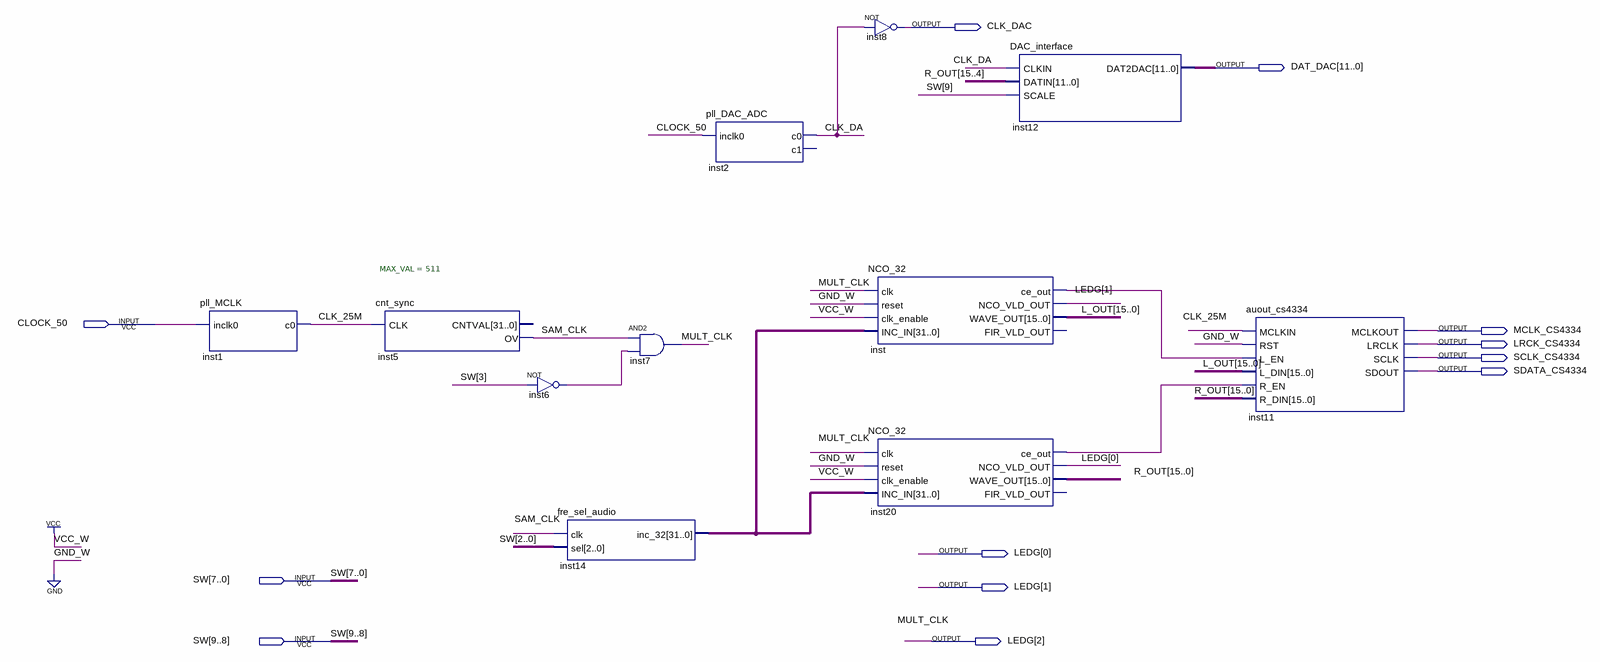
[diagram p0: schematic sheet]
// Quartus schematic NCO_quartus.bdf as structural Verilog: 11 symbols, 12 pins
module NCO_quartus (
  input  CLOCK_50,
  input  [9:0] SW,
  output CLK_DAC,
  output [11:0] DAT_DAC,
  output MCLK_CS4334,
  output LRCK_CS4334,
  output SCLK_CS4334,
  output SDATA_CS4334,
  output [2:0] LEDG
);

  wire CLK_25M, CLK_DA, inst6_out, inst20_ce_out, inst_ce_out, SAM_CLK;
  wire [15:0] L_OUT, R_OUT;
  wire [31:0] inst14_inc_32;

  pll_MCLK inst1 (.inclk0(CLOCK_50), .c0(CLK_25M));
  cnt_sync #(.MAX_VAL(511)) inst5 (.CLK(CLK_25M), .OV(SAM_CLK));  // open: CNTVAL
  not inst6 (inst6_out, SW[3]);
  fre_sel_audio inst14 (.clk(SAM_CLK), .sel(SW[2:0]), .inc_32(inst14_inc_32));
  and inst7 (LEDG[2], SAM_CLK, inst6_out);
  pll_DAC_ADC inst2 (.inclk0(CLOCK_50), .c0(CLK_DA));  // open: c1
  not inst8 (CLK_DAC, CLK_DA);
  NCO_32 inst (
    .clk(LEDG[2]), .reset(1'b0), .clk_enable(1'b1), .INC_IN(inst14_inc_32), .ce_out(inst_ce_out),
    .NCO_VLD_OUT(LEDG[1]), .WAVE_OUT(L_OUT));  // open: FIR_VLD_OUT
  NCO_32 inst20 (
    .clk(LEDG[2]), .reset(1'b0), .clk_enable(1'b1), .INC_IN(inst14_inc_32), .ce_out(inst20_ce_out),
    .NCO_VLD_OUT(LEDG[0]), .WAVE_OUT(R_OUT));  // open: FIR_VLD_OUT
  DAC_interface inst12 (.CLKIN(CLK_DA), .DATIN(R_OUT[15:4]), .SCALE(SW[9]), .DAT2DAC(DAT_DAC));
  auout_cs4334 inst11 (
    .MCLKIN(CLK_25M), .RST(1'b0), .L_EN(inst_ce_out), .L_DIN(L_OUT), .R_EN(inst20_ce_out), .R_DIN(R_OUT),
    .MCLKOUT(MCLK_CS4334), .LRCLK(LRCK_CS4334), .SCLK(SCLK_CS4334), .SDOUT(SDATA_CS4334));

  // Other names for the same wires on the sheet: MULT_CLK = LEDG[2]
endmodule
